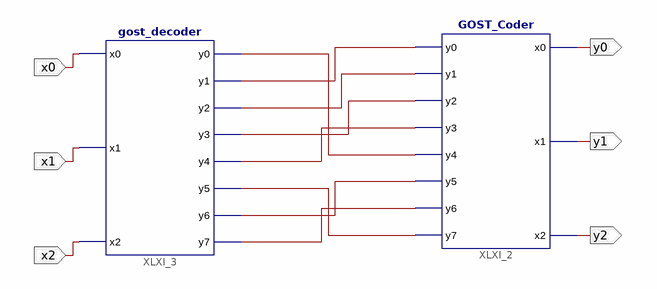
[diagram p0: schematic sheet 1]
// Xilinx ISE schematic gost_box_sch.sch (xbr) as structural Verilog: 2 symbols, 6 ports
module gost_box_sch (
  input  x0,
  input  x1,
  input  x2,
  output y1,
  output y0,
  output y2
);

  wire XLXN_23, XLXN_24, XLXN_25, XLXN_26, XLXN_27, XLXN_28, XLXN_29, XLXN_30;

  GOST_Coder XLXI_2 (
    .y0(XLXN_24), .y1(XLXN_25), .y2(XLXN_26), .y3(XLXN_27), .y4(XLXN_23), .y5(XLXN_29), .y6(XLXN_30),
    .y7(XLXN_28), .x0(y0), .x1(y1), .x2(y2));
  gost_decoder XLXI_3 (
    .x0(x0), .x1(x1), .x2(x2), .y0(XLXN_23), .y1(XLXN_24), .y2(XLXN_25), .y3(XLXN_26), .y4(XLXN_27),
    .y5(XLXN_28), .y6(XLXN_29), .y7(XLXN_30));
endmodule
